# EAGLE design shield (EAGLE 6.0)
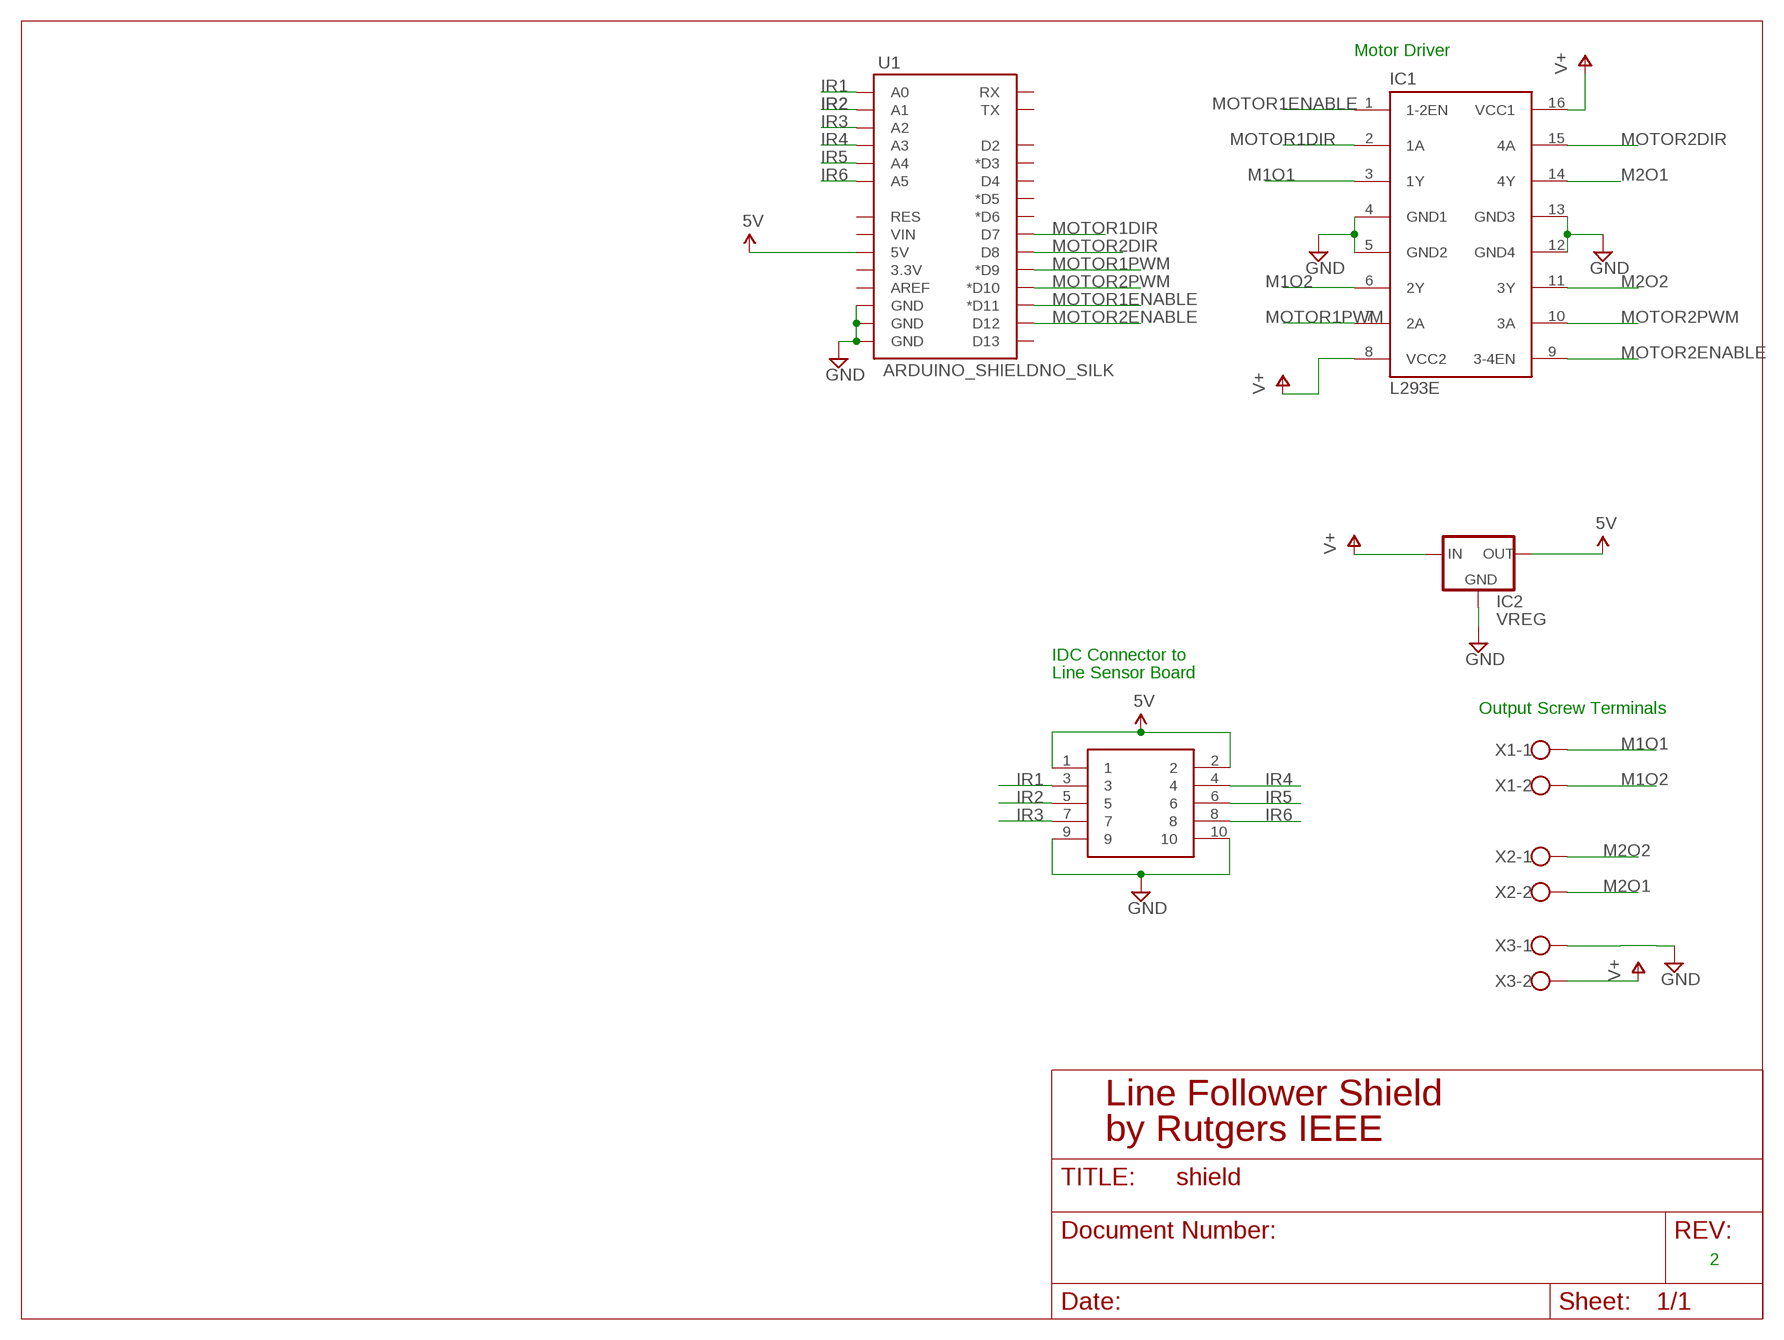
[diagram p0: schematic, sheet 1]

## Parts
IC1  L293E  [DIL16]
IC2  VREG  V_REG_78XX-TO-220  [TO-220-ALT]
U1  ARDUINO_SHIELDNO_SILK  [DUEMILANOVE_VIAS]
U$3  2X5-PHEADER  [2X5-SHROUDED-HEADER]
X1  W237-102  [W237-102]
X2  W237-102  [W237-102]
X3  W237-102  [W237-102]

## Nets
5V: IC2.OUT U1.5V U$3.1 U$3.2
9V: IC1.8(VCC2) IC1.16(VCC1) IC2.IN X3.2 ; supply symbol labelled V+
GND: IC1.4(GND1) IC1.5(GND2) IC1.12(GND4) IC1.13(GND3) IC2.GND U1.GND@0(GND) U1.GND@1(GND) U1.GND@2(GND) U$3.9 U$3.10 X3.1
IR1: U1.A0 U$3.3
IR2: U1.A1 U$3.5
IR3: U1.A2 U$3.7
IR4: U1.A3 U$3.4
IR5: U1.A4 U$3.6
IR6: U1.A5 U$3.8
M1O1: IC1.3(1Y) X1.1
M1O2: IC1.6(2Y) X1.2
M2O1: IC1.14(4Y) X2.2
M2O2: IC1.11(3Y) X2.1
MOTOR1DIR: IC1.2(1A) U1.D7
MOTOR1ENABLE: IC1.1(1-2EN) U1.D11(*D11)
MOTOR1PWM: IC1.7(2A) U1.D9(*D9)
MOTOR2DIR: IC1.15(4A) U1.D8
MOTOR2ENABLE: IC1.9(3-4EN) U1.D12
MOTOR2PWM: IC1.10(3A) U1.D10(*D10)
Unconnected: U1.3.3V U1.AREF U1.D2 U1.D3(*D3) U1.D4 U1.D5(*D5) U1.D6(*D6) U1.D13 U1.RES U1.RX U1.TX U1.VIN

## Notes on the sheet
- Motor Driver
- IDC Connector to
- Line Sensor Board
- Output Screw Terminals
- Line Follower Shield
- by Rutgers IEEE
- 2

## Library data of the parts
IC1 = texas:L293E: TI DEVICE
IC2 = SparkFun-PowerIC:V_REG_78XX: Voltage Regulator Standard 7805 5V regulator. IGO (Input Ground Output). Spark Fun Electronics SKU : COM-00107
U1 = SparkFun:ARDUINO_SHIELD
U$3 = linelib:2X5-PHEADER
X1-X3 = con-wago-500:W237-102: WAGO SCREW CLAMP

## Board
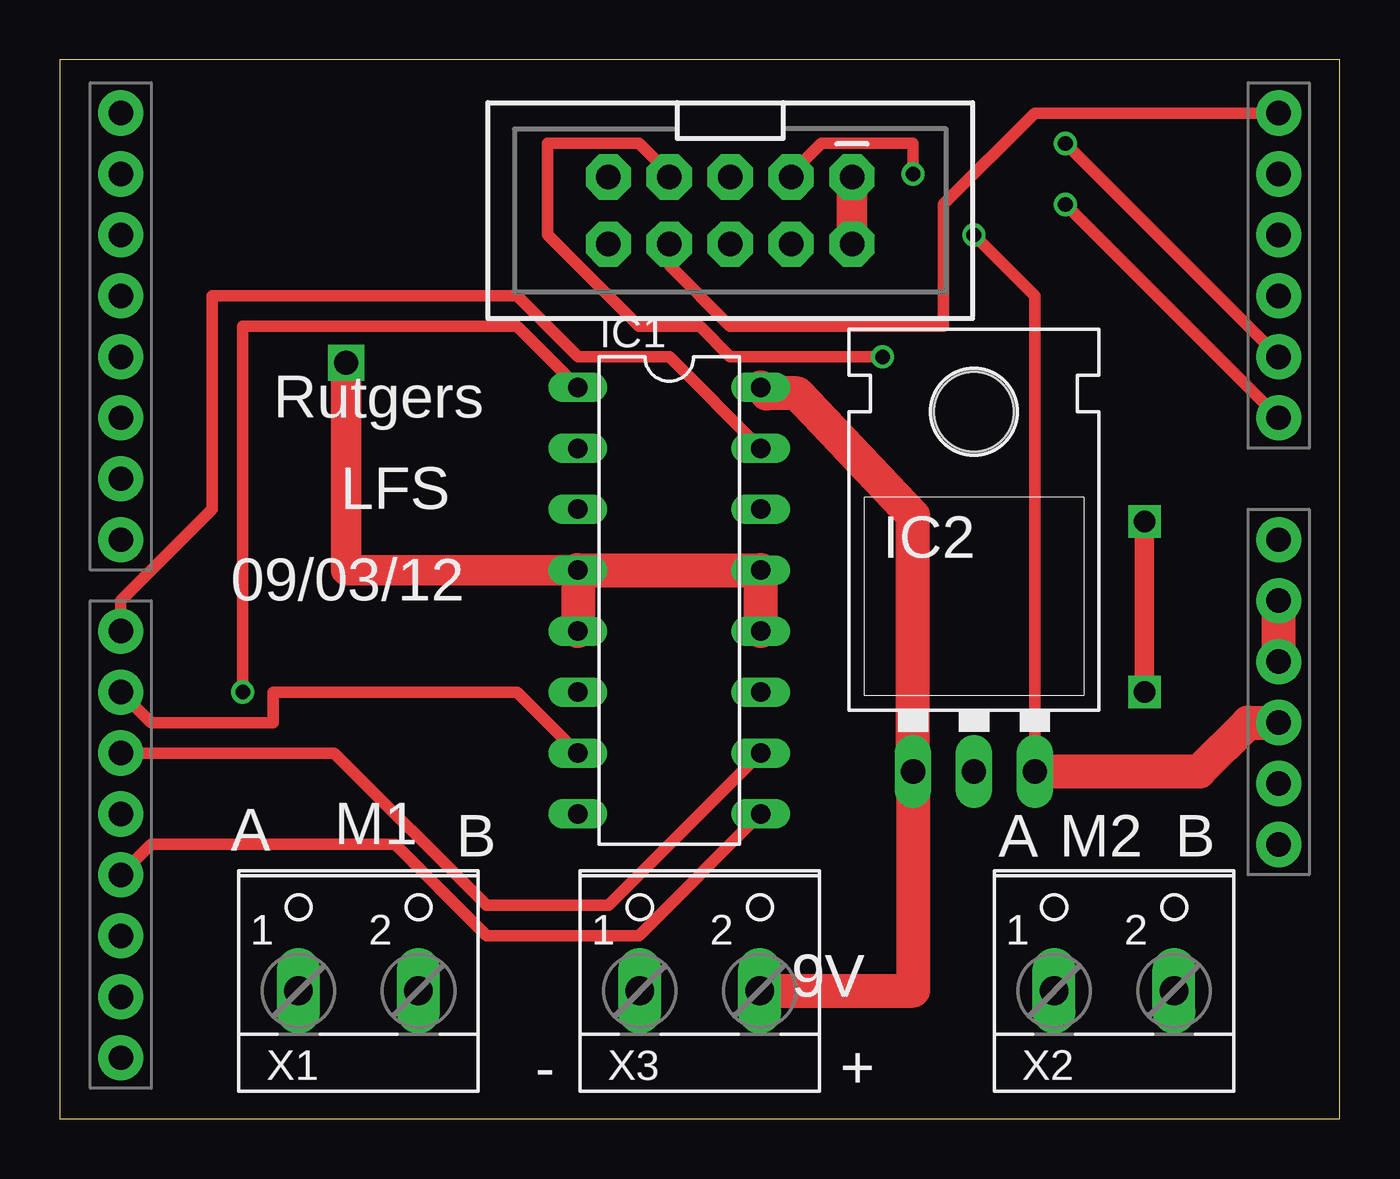
[diagram p1: board, top side]
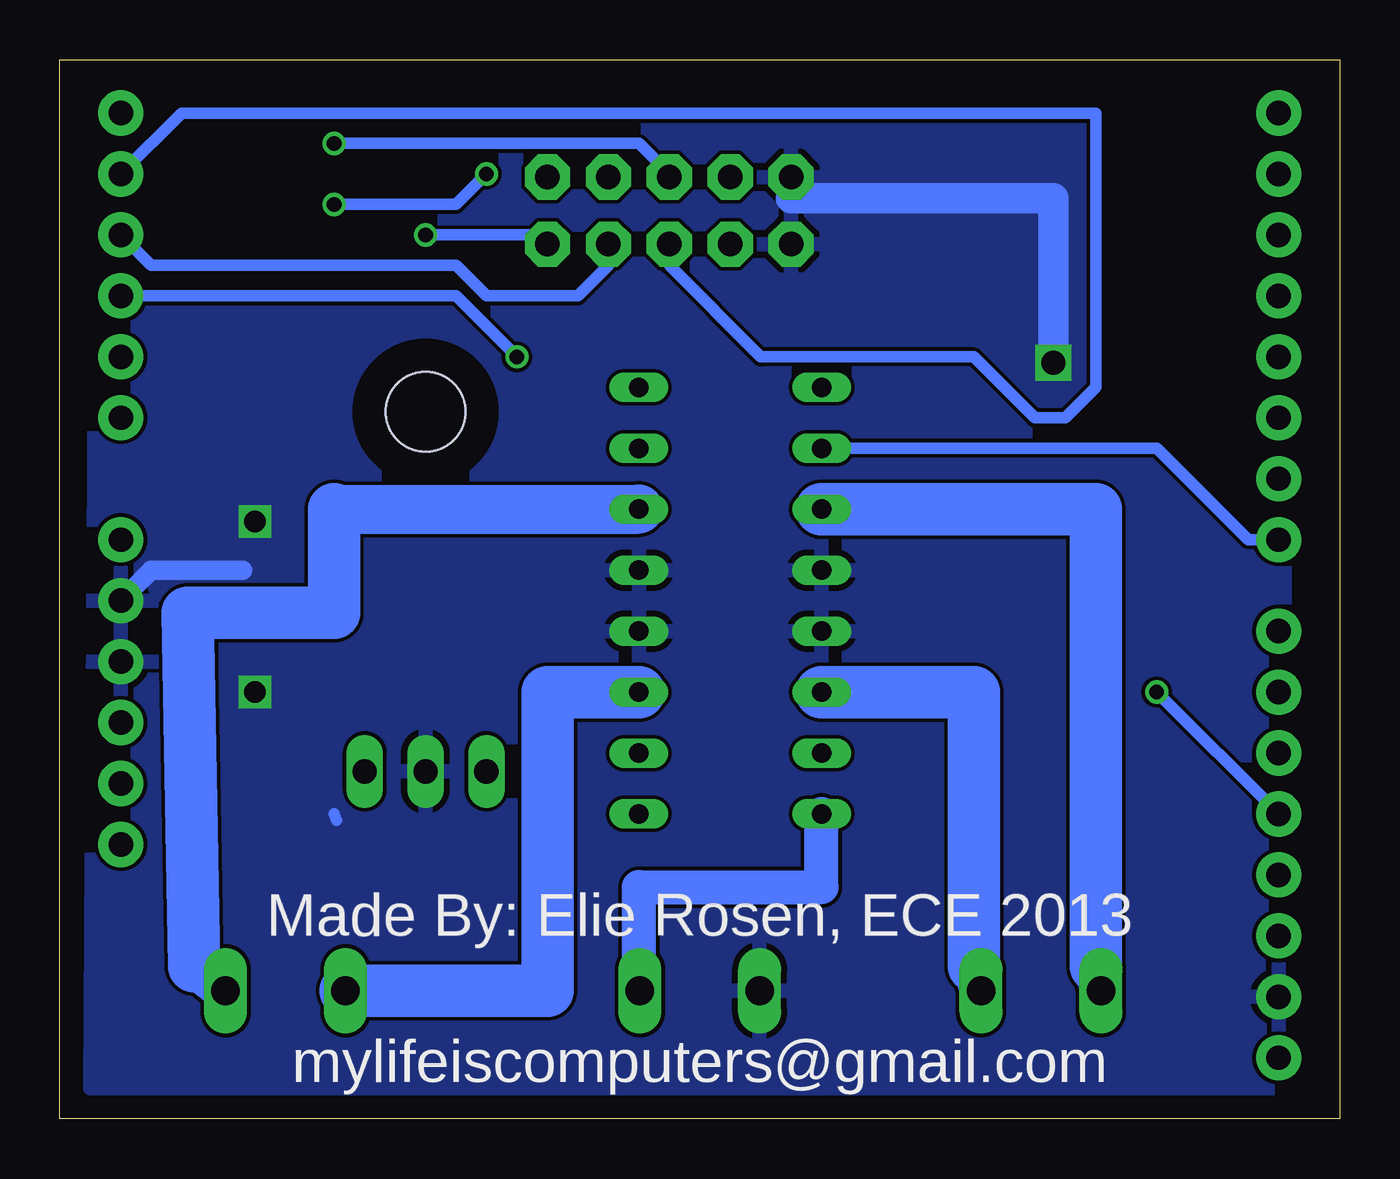
[diagram p2: board, bottom side, seen from below]

Size 53.34 x 44.12 mm. Coordinates in mm from the lower left corner, seen from the top.
Outline: 0,0 53.34,0 53.34,44.12 0,44.12 0,0
Copper layers (1*16): Top 0.0356mm / dielectric 1.5011mm / Bottom 0.0356mm
Design rules: minimum track width 6mil, minimum drill 13mil, track to track 6mil, track to pad 6mil, pad to pad 6mil, via to via 6mil, smd to smd 6mil, copper to edge 15mil, drill to drill 6mil, minimum pad ring 7mil, minimum via ring 7mil, stop-mask expansion 4mil, vias tented up to drill 0mil, thermal gap 10mil

### Footprints (pad centres in the part's own frame; a part is rotated, then mirrored left to right if it is on the bottom)
DIL16 = drill 0.813 long: 1 -8.89,-3.81; 2 -6.35,-3.81; 3 -3.81,-3.81; 4 -1.27,-3.81; 5 1.27,-3.81; 6 3.81,-3.81; 7 6.35,-3.81; 8 8.89,-3.81; 9 8.89,3.81; 10 6.35,3.81; 11 3.81,3.81; 12 1.27,3.81; 13 -1.27,3.81; 14 -3.81,3.81; 15 -6.35,3.81; 16 -8.89,3.81
TO-220-ALT = drill 1.016 long: GND 0,-3.81; IN -2.54,-3.81; OUT 2.54,-3.81 | hole 3.302: 0,11.176
DUEMILANOVE_VIAS = drill 1.016 pad 1.88: 3.3V 50.8,13.97; 5V 50.8,16.51; A0 50.8,29.21; A1 50.8,31.75; A2 50.8,34.29; A3 50.8,36.83; A4 50.8,39.37; A5 50.8,41.91; AREF 2.54,2.54; D2 2.54,36.83; D3 2.54,34.29; D4 2.54,31.75; D5 2.54,29.21; D6 2.54,26.67; D7 2.54,24.13; D8 2.54,20.32; D9 2.54,17.78; D10 2.54,15.24; D11 2.54,12.7; D12 2.54,10.16; D13 2.54,7.62; GND@0 50.8,19.05; GND@1 50.8,21.59; GND@2 2.54,5.08; RES 50.8,11.43; RX 2.54,41.91; TX 2.54,39.37; VIN 50.8,24.13
2X5-SHROUDED-HEADER = drill 1.016 pad 1.88 octagon: 1 3.683,15.24; 2 6.477,15.24; 3 3.683,12.7; 4 6.477,12.7; 5 3.683,10.16; 6 6.477,10.16; 7 3.683,7.62; 8 6.477,7.62; 9 3.683,5.08; 10 6.477,5.08
W237-102 = drill 1.194 long: 1 -2.5,-1.27; 2 2.5,-1.27

### Placement (x,y rotation side)
IC1  25.4,21.59 270 top
IC2  38.1,18.29 0 top
U1  0,0 0 top
U$3  17.78,42.93 270 top
X1  12.45,6.6 0 top
X2  43.94,6.6 0 top
X3  26.67,6.6 0 top

### Tracks (layer width: path | path; a pad name or v marks a point on that pad's centre or on a via)
5V  (via drill 0.61)
  Top 0.484: 33.02,39.37 U$3.1 | v38.1,36.83 40.64,34.29 IC2.OUT
  Top 1.27: U$3.1 U$3.2
  Top 1.422: IC2.OUT 47.5,14.48 49.53,16.51 U1.5V
  Bottom 0.484: v38.1,36.83 33.02,36.83 U$3.2
9V
  Top 1.422: X3.2 35.56,5.33 IC2.IN 35.56,25.15 30.73,30.23 29.46,30.23 IC1.16
  Bottom 1.422: X3.2 29.21,5.33 29.21,9.65 21.59,9.65 IC1.8
GND  (via drill 0.9, 1)
  Top 0.813: v45.21,24.89 v45.21,17.78
  Top 1.27: IC1.4 11.94,22.86 v11.94,31.5
  Top 1.422: IC1.5 IC1.4 IC1.13 IC1.12 | U1.GND@0 U1.GND@1
  Bottom 0.484: 41.91,12.7 41.8,12.43
  Bottom 0.813: 45.72,22.86 49.53,22.86 U1.GND@1 51.05,21.34
  Bottom 1.27: v11.94,31.5 11.94,38.35 22.86,38.35
  pour Bottom: 2.29,1.27 2.29,43.18 51.82,43.18 52.07,1.27
IR1  (via drill 0.61)
  Top 0.484: v35.56,39.37 35.56,40.64 31.75,40.64 30.48,39.37 U$3.3 | U1.A0 v41.91,38.1
  Bottom 0.484: v35.56,39.37 36.83,38.1 v41.91,38.1
IR2  (via drill 0.61)
  Top 0.484: U1.A1 v41.91,40.64
  Bottom 0.484: v41.91,40.64 29.21,40.64 27.94,39.37 U$3.5
IR3  (via drill 0.61)
  Top 0.484: v34.29,31.75 27.94,31.75 26.67,33.02 24.13,33.02 20.32,36.83 20.32,40.64 24.13,40.64 25.4,39.37 U$3.7
  Bottom 0.484: v34.29,31.75 36.83,34.29 U1.A2
IR4
  Bottom 0.484: U1.A3 49.53,35.56 36.83,35.56 35.56,34.29 31.75,34.29 30.48,35.56 U$3.4
IR5
  Bottom 0.484: U1.A4 48.26,41.91 10.16,41.91 10.16,30.48 11.43,29.21 12.7,29.21 15.24,31.75 24.13,31.75 27.94,35.56 U$3.6
IR6
  Top 0.484: U1.A5 40.64,41.91 36.83,38.1 36.83,33.02 27.94,33.02 25.4,35.56 U$3.8
M1O1
  Bottom 1.778: X1.1 10.16,6.35
  Bottom 2.184: 10.16,6.35 10.16,25.4 IC1.3
M1O2
  Bottom 1.778: X1.2 15.24,6.35
  Bottom 2.184: 15.24,6.35 15.24,17.78 IC1.6
M2O1
  Bottom 1.778: X2.2 47.75,6.35
  Bottom 2.032: 41.91,25.4 IC1.14
  Bottom 2.184: 47.75,6.35 48.01,21.08 41.91,21.08 41.91,25.4
M2O2
  Bottom 2.184: IC1.11 33.02,17.78 33.02,5.33 X2.1
MOTOR1DIR
  Bottom 0.484: IC1.2 7.62,27.94 3.81,24.13 U1.D7
MOTOR1ENABLE  (via drill 0.61)
  Top 0.484: IC1.1 19.05,33.02 7.62,33.02 v7.62,17.78
  Bottom 0.484: U1.D11 v7.62,17.78
MOTOR1PWM
  Top 0.484: IC1.7 19.05,17.78 8.89,17.78 8.89,16.51 3.81,16.51 U1.D9
MOTOR2DIR
  Top 0.484: IC1.15 25.4,31.75 21.59,31.75 19.05,34.29 6.35,34.29 6.35,25.4 2.54,21.59 U1.D8
MOTOR2ENABLE
  Top 0.484: IC1.9 24.13,7.62 17.78,7.62 13.97,11.43 3.81,11.43 U1.D12
MOTOR2PWM
  Top 0.484: IC1.10 22.86,8.89 17.78,8.89 11.43,15.24 U1.D10

### Text on the board
tPlace: Rutgers | LFS | 09/03/12 | A | M1 | B | A | M2 | B | 9V | 9V | - | +
bPlace: Made By: Elie Rosen, ECE 2013 | mylifeiscomputers@gmail.com